# EAGLE design Doser (EAGLE 5.11)
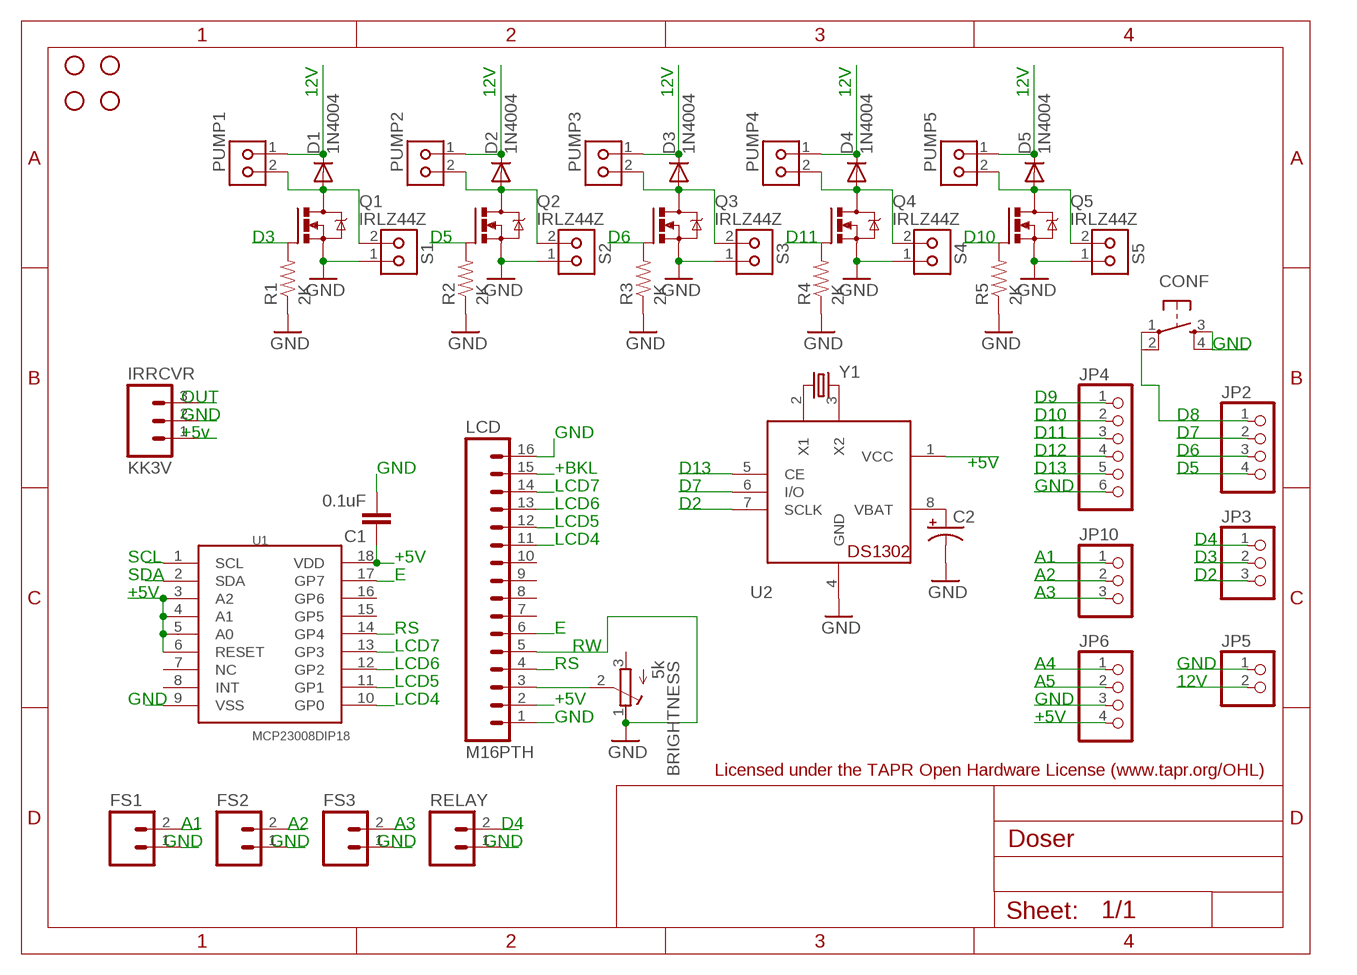
[diagram p0: schematic, sheet 1]

## Parts
BRIGHTNESS  5k  R-TRIMMT93YA  [RTRIMT93YA]
C1  0.1uF  CAPPTH  [CAP-PTH-SMALL]
C2  SUPERCAP  [414-VA5R]
CONF  TAC_SWITCHPTH  [TACTILE-PTH]
D1  1N4004  [DO41-10]
D2  1N4004  [DO41-10]
D3  1N4004  [DO41-10]
D4  1N4004  [DO41-10]
D5  1N4004  [DO41-10]
FS1  M02POLAR  [MOLEX-1X2]
FS2  M02POLAR  [MOLEX-1X2]
FS3  M02POLAR  [MOLEX-1X2]
IRRCVR  KK3V  M03POLAR  [MOLEX-1X3]
JP2  PINHD-1X4  [1X04]
JP3  PINHD-1X3  [1X03]
JP4  PINHD-1X6  [1X06]
JP5  PINHD-1X2  [1X02]
JP6  PINHD-1X4  [1X04]
JP10  PINHD-1X3  [1X03]
JP11  STAND-OFF  [STAND-OFF]
JP12  STAND-OFF  [STAND-OFF]
JP13  STAND-OFF  [STAND-OFF]
JP14  STAND-OFF  [STAND-OFF]
LCD  M16PTH  [1X16]
PUMP1  KK2VSQ  [KK-V-2-SQ]
PUMP2  KK2VSQ  [KK-V-2-SQ]
PUMP3  KK2VSQ  [KK-V-2-SQ]
PUMP4  KK2VSQ  [KK-V-2-SQ]
PUMP5  KK2VSQ  [KK-V-2-SQ]
Q1  IRLZ44Z  [TO220BH]
Q2  IRLZ44Z  [TO220BH]
Q3  IRLZ44Z  [TO220BH]
Q4  IRLZ44Z  [TO220BH]
Q5  IRLZ44Z  [TO220BH]
R1  2K  RESISTORPTH-1/4W  [AXIAL-0.4]
R2  2K  RESISTORPTH-1/4W  [AXIAL-0.4]
R3  2K  RESISTORPTH-1/4W  [AXIAL-0.4]
R4  2K  RESISTORPTH-1/4W  [AXIAL-0.4]
R5  2K  RESISTORPTH-1/4W  [AXIAL-0.4]
RELAY  M02POLAR  [MOLEX-1X2]
S1  KK2VSQ  [KK-V-2-SQ]
S2  KK2VSQ  [KK-V-2-SQ]
S3  KK2VSQ  [KK-V-2-SQ]
S4  KK2VSQ  [KK-V-2-SQ]
S5  KK2VSQ  [KK-V-2-SQ]
U1  MCP23008DIP18  [DIL18]
U2  DS1302  [DIL08-ROUND]
Y1  CRYSTALTC26H  [TC26H]

## Nets
+5V [power]: C1.1 IRRCVR.1 JP6.4 LCD.2 U1.3(A2) U1.4(A1) U1.5(A0) U1.6(RESET) U1.18(VDD) U2.1(VCC)
A1: FS1.2 JP10.1
A2: FS2.2 JP10.2
A3: FS3.2 JP10.3
D8: CONF.1 CONF.2 JP2.1
D9: JP4.1 LCD.15
D10: JP4.2 Q5.G R5.P$2
D11: JP4.3 Q4.G R4.P$2
D12: IRRCVR.3 JP4.4
D13: JP4.5 U2.5(CE)
E1: LCD.6 U1.17(GP7)
GND [power]: BRIGHTNESS.1(A) C1.2 C2.- CONF.3 CONF.4 FS1.1 FS2.1 FS3.1 IRRCVR.2 JP4.6 JP5.1 JP6.3 LCD.1 LCD.5 LCD.16 Q1.S Q2.S Q3.S Q4.S Q5.S R1.P$1 R2.P$1 R3.P$1 R4.P$1 R5.P$1 RELAY.1 S1.1 S2.1 S3.1 S4.1 S5.1 U1.9(VSS) U2.4(GND)
LCD4: LCD.11 U1.10(GP0)
LCD5: LCD.12 U1.11(GP1)
LCD6: LCD.13 U1.12(GP2)
LCD7: LCD.14 U1.13(GP3)
N$1: D2.A PUMP2.2 Q2.D S2.2
N$2: D1.A PUMP1.2 Q1.D S1.2
N$3: U2.2(X1) Y1.1
N$4: U2.3(X2) Y1.2
N$5: D3.A PUMP3.2 Q3.D S3.2
N$6: C2.+ U2.8(VBAT)
N$7: D4.A PUMP4.2 Q4.D S4.2
N$9: D5.A PUMP5.2 Q5.D S5.2
N$10: BRIGHTNESS.2(S) LCD.3
RD2: JP3.3 U2.7(SCLK)
RD3: JP3.2 Q1.G R1.P$2
RD4: JP3.1 RELAY.2
RD5: JP2.4 Q2.G R2.P$2
RD6: JP2.3 Q3.G R3.P$2
RD7: JP2.2 U2.6(I/O)
RS1: LCD.4 U1.14(GP4)
SCL: JP6.2 U1.1(SCL)
SDA: JP6.1 U1.2(SDA)
VIN: D1.C D2.C D3.C D4.C D5.C JP5.2 PUMP1.1 PUMP2.1 PUMP3.1 PUMP4.1 PUMP5.1
Unconnected: BRIGHTNESS.3(E) LCD.7 LCD.8 LCD.9 LCD.10 U1.7(NC) U1.8(INT) U1.15(GP5) U1.16(GP6)

## Notes on the sheet
- 12V | 12V | 12V | 12V | 12V
- D3 | D5 | D6 | D11 | D10
- GND
- OUT | D9
- GND | D10 | D8
- +5v | GND | D11 | D7
- +5V | D12 | D6
- GND | +BKL | D13 | D13 | D5
- LCD7 | D7 | GND
- LCD6 | D2
- LCD5
- LCD4 | D4
- SCL | +5V | A1 | D3
- SDA | E | A2 | D2
- +5V | A3
- RS | E
- LCD7 | RW
- LCD6 | RS | A4 | GND
- LCD5 | A5 | 12V
- GND | LCD4 | +5V | GND
- GND | +5V
- Licensed under the TAPR Open Hardware License (www.tapr.org/OHL)
- A1 | A2 | A3 | D4
- GND | GND | GND | GND

## Library data of the parts
BRIGHTNESS = resistor:R-TRIMM: Trimm resistor
C1 = _allyourbase:CAP: Capacitor Standard 0603 ceramic capacitor, and 0.1" leaded capacitor.
C2 = adafruit:SUPERCAP
CONF = SparkFun:TAC_SWITCH: Momentary Switch Button commonly used for reset or general input. Spark Fun Electronics SKU : COM-00097
D1-D5 = diode:1N4004: DIODE general purpose rectifier, 1 A
FS1-FS3 RELAY = SparkFun:M02: Header 2 Standard 2-pin 0.1" header. Use with straight break away headers (SKU : PRT-00116), right angle break away headers (PRT-00553), swiss pins (PRT-00743), machine pins (PRT-00117), and female headers (PRT-00115). Molex polarized connector foot print use with SKU : PRT-08233 with associated crimp pins and housings.
IRRCVR = SparkFun:M03: Header 3 Standard 3-pin 0.1" header. Use with straight break away headers (SKU : PRT-00116), right angle break away headers (PRT-00553), swiss pins (PRT-00743), machine pins (PRT-00117), and female headers (PRT-00115). Molex polarized connector foot print use with SKU : PRT-08232 with associated crimp pins and housings.
JP2 JP6 = pinhead:PINHD-1X4: PIN HEADER
JP3 JP10 = pinhead:PINHD-1X3: PIN HEADER
JP4 = pinhead:PINHD-1X6: PIN HEADER
JP5 = pinhead:PINHD-1X2: PIN HEADER
JP11-JP14 = SparkFun:STAND-OFF: Stand Off This is the mechanical footprint for a #4 phillips button head screw. Use the keepout ring to avoid running the screw head into surrounding components. SKU : PRT-00447
LCD = SparkFun:M16
PUMP1-PUMP5 S1-S5 = molex-kk:KK2*: Molex KK 2-pin connector, 100 mil pin spacing
Q1-Q5 = transistor-power:IRLZ44Z: N-Channel HEXFET® Power MOSFET Logic Level AUTOMOTIVE MOSFET Source: http://www.irf.com/product-info/datasheets/data/irlz44zpbf.pdf
R1-R5 = SparkFun:RESISTOR: Resistor Basic schematic elements and footprints for 0603, 1206, and PTH resistors.
U1 = _allyourbase:MCP23008
U2 = adafruit:DS1302: DS1302 - Real time clock with supercap trickle charger
Y1 = SparkFun:CRYSTAL: Crystals Various standard crystals. Proven footprints. Spark Fun Electronics SKU : COM-00534

## Net classes
0 default: width 0.203 mm, drill 0.508 mm, clearance 0.203 mm
1 power: width 0.254 mm, drill 0.508 mm, clearance 0.203 mm

## Board
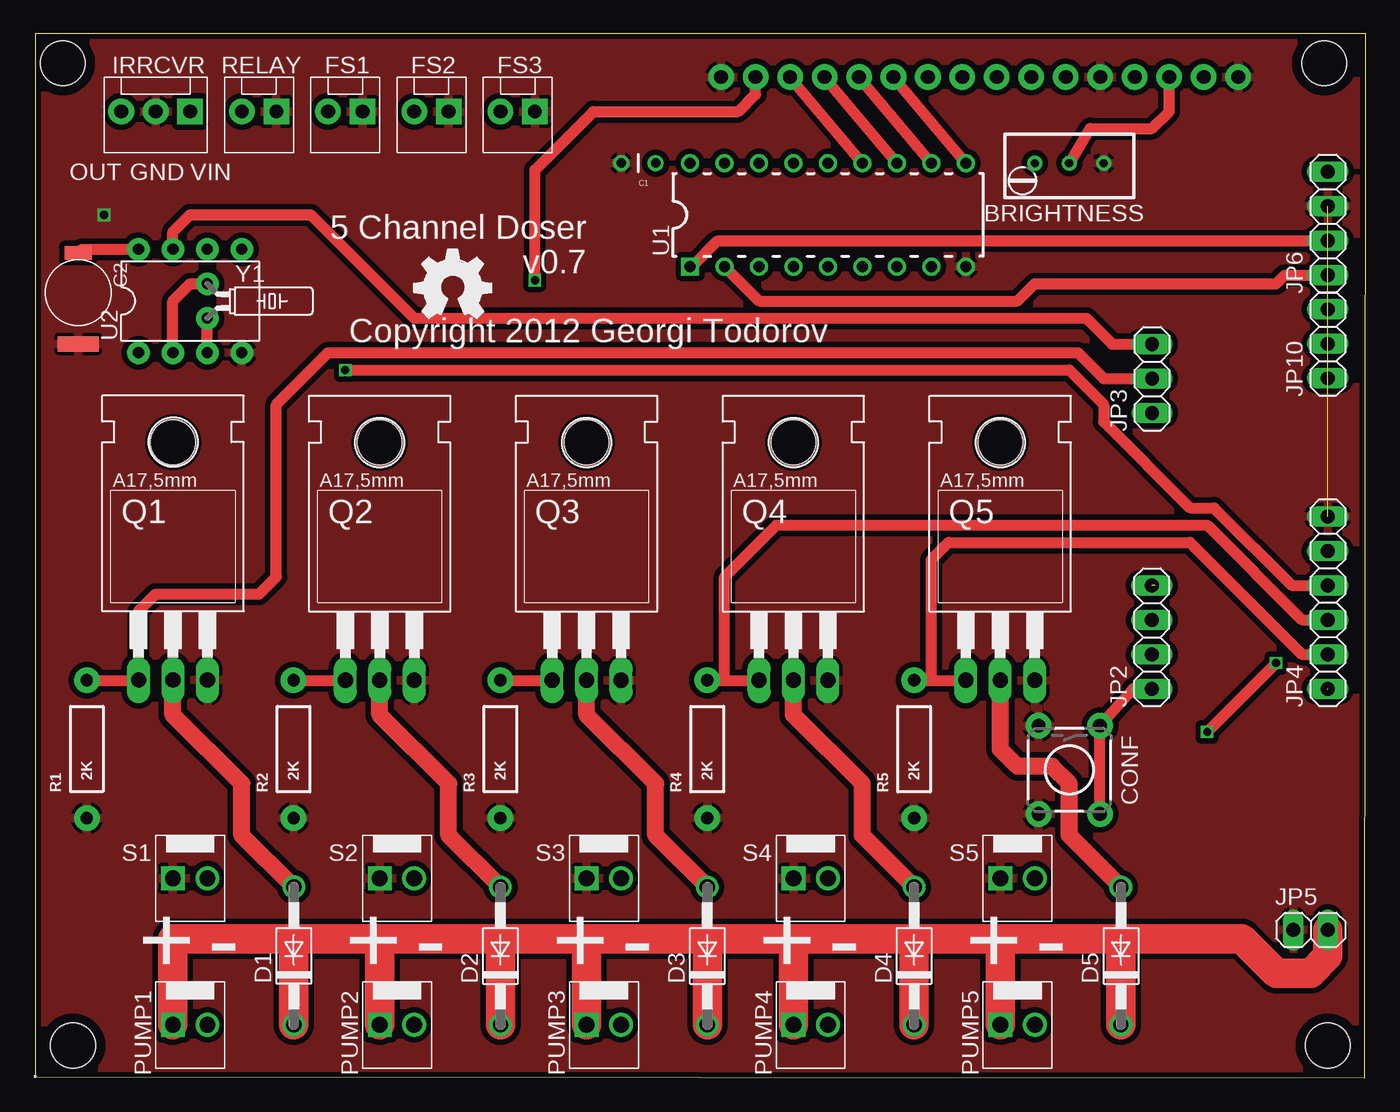
[diagram p1: board, top side]
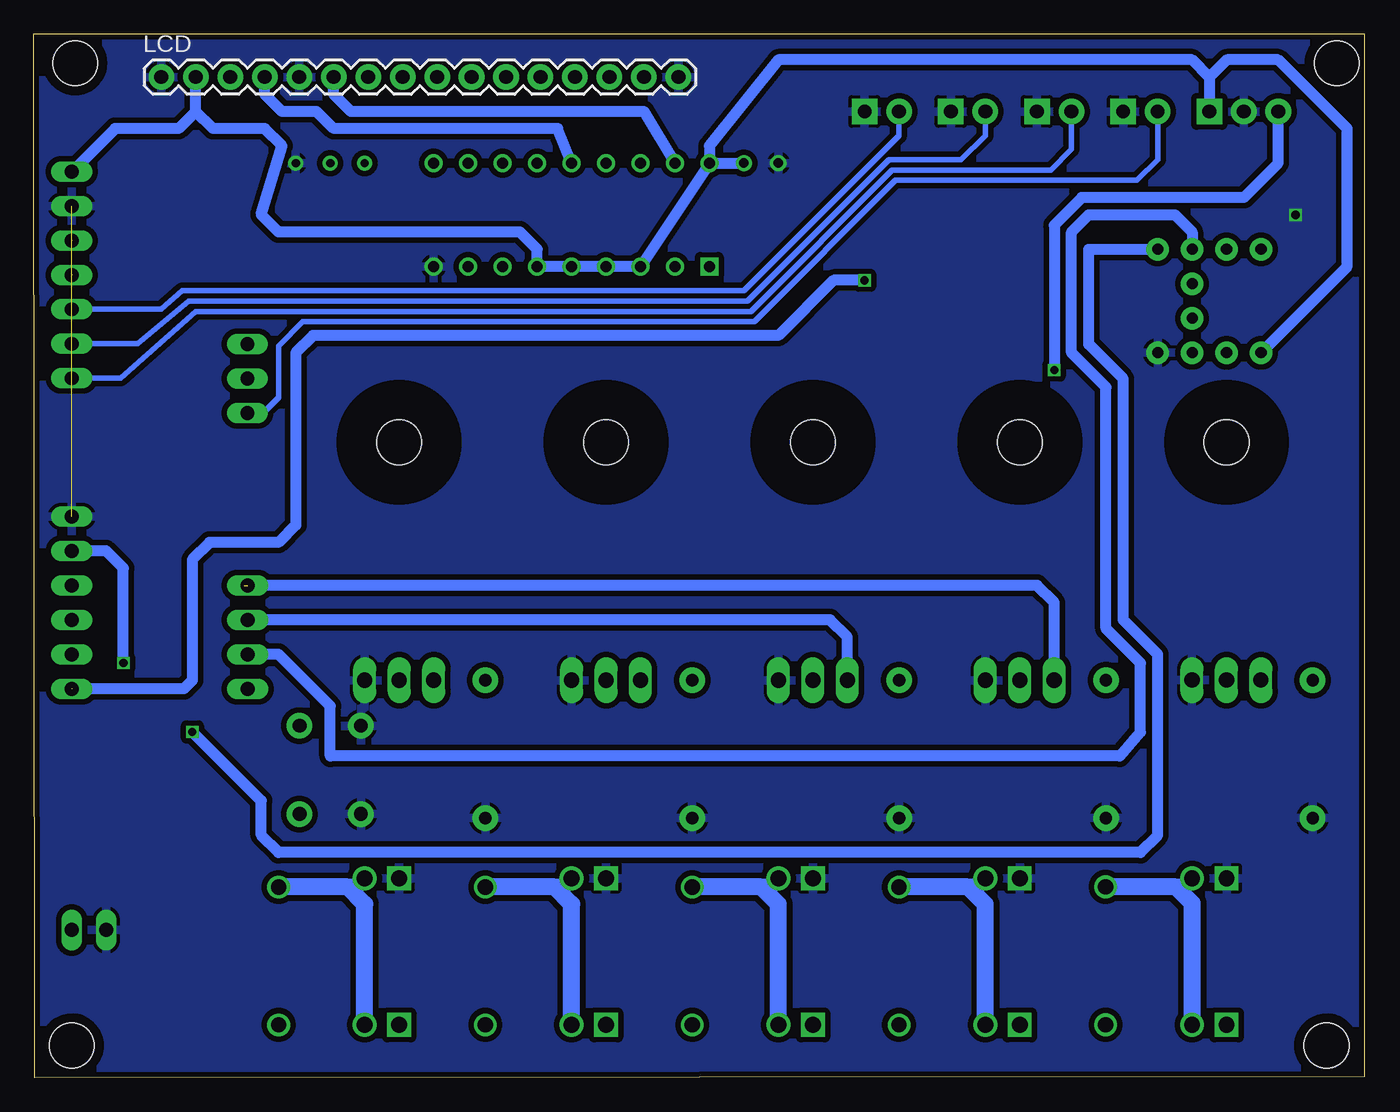
[diagram p2: board, bottom side, seen from below]

Size 98.03 x 76.91 mm. Coordinates in mm from the lower left corner, seen from the top.
Outline: 0,0.08 97.98,0 98.03,76.91 0,76.91 0,0.08
Copper layers (1*16): Top 0.035mm / dielectric 1.5mm / Bottom 0.035mm
Design rules "Fusion_eagle_rule_v1.1": minimum track width 6mil, minimum drill 12mil, track to track 6mil, track to pad 6mil, pad to pad 6mil, via to via 6mil, smd to smd 0mil, copper to edge 10mil, drill to drill 10mil, minimum pad ring 10mil, minimum via ring 6mil, stop-mask expansion 2mil, vias tented up to drill 100mil, thermal gap 10mil

### Footprints (pad centres in the part's own frame; a part is rotated, then mirrored left to right if it is on the bottom)
RTRIMT93YA = drill 0.61 round: 1 0,-2.54; 2 0,0; 3 0,2.54
CAP-PTH-SMALL = drill 0.7 round: 1 0,0; 2 2.54,0
414-VA5R = smd 1 x 2: + -2.9,0 | smd 1.1 x 3: - 3.8,0
TACTILE-PTH = drill 1.016 pad 1.88 round: 1 -3.251,2.261; 2 3.251,2.261; 3 -3.251,-2.261; 4 3.251,-2.261
DO41-10 = drill 1.118 round: A 5.08,0; C -5.08,0
MOLEX-1X2 = drill 1.016 pad 1.88 square: 1 0,0 | drill 1.016 pad 1.88 round: 2 2.54,0
MOLEX-1X3 = drill 1.016 pad 1.88 square: 1 0,0 | drill 1.016 pad 1.88 round: 2 2.54,0; 3 5.08,0
1X04 = drill 1.016 long: 1 -3.81,0; 2 -1.27,0; 3 1.27,0; 4 3.81,0
1X03 = drill 1.016 long: 1 -2.54,0; 2 0,0; 3 2.54,0
1X06 = drill 1.016 long: 1 -6.35,0; 2 -3.81,0; 3 -1.27,0; 4 1.27,0; 5 3.81,0; 6 6.35,0
1X02 = drill 1.016 long: 1 -1.27,0; 2 1.27,0
STAND-OFF = hole 3.302: 0,0
1X16 = drill 1.016 pad 1.88 round: 1 0,0; 2 2.54,0; 3 5.08,0; 4 7.62,0; 5 10.16,0; 6 12.7,0; 7 15.24,0; 8 17.78,0; 9 20.32,0; 10 22.86,0; 11 25.4,0; 12 27.94,0; 13 30.48,0; 14 33.02,0; 15 35.56,0; 16 38.1,0
KK-V-2-SQ = drill 1.168 square: 1 0,1.27 | drill 1.168 round: 2 0,-1.27
TO220BH = drill 1.118 long: D 0,-6.35; G -2.54,-6.35; S 2.54,-6.35 | hole 3.302: 0,11.176
AXIAL-0.4 = drill 0.9 pad 1.88 round: P$1 -5.08,0; P$2 5.08,0
DIL18 = drill 0.813 square: 1 -10.16,-3.81 | drill 0.813 round: 2 -7.62,-3.81; 3 -5.08,-3.81; 4 -2.54,-3.81; 5 0,-3.81; 6 2.54,-3.81; 7 5.08,-3.81; 8 7.62,-3.81; 9 10.16,-3.81; 10 10.16,3.81; 11 7.62,3.81; 12 5.08,3.81; 13 2.54,3.81; 14 0,3.81; 15 -2.54,3.81; 16 -5.08,3.81; 17 -7.62,3.81; 18 -10.16,3.81
DIL08-ROUND = drill 0.813 pad 1.676 round: 1 -3.81,-3.81; 2 -1.27,-3.81; 3 1.27,-3.81; 4 3.81,-3.81; 5 3.81,3.81; 6 1.27,3.81; 7 -1.27,3.81; 8 -3.81,3.81
TC26H = drill 0.813 pad 1.676 round: 1 -1.27,0; 2 1.27,0

### Placement (x,y rotation side)
BRIGHTNESS  76.2,67.39 90 top
C1  45.72,67.39 180 top
C2  3.17,57.86 270 top
CONF  76.2,22.68 270 top
D1  19.07,8.98 90 top
D2  34.29,8.97 90 top
D3  49.53,8.97 90 top
D4  64.77,8.97 90 top
D5  80.01,8.97 90 top
FS1  24.13,71.2 180 top
FS2  30.48,71.2 180 top
FS3  36.83,71.2 180 top
IRRCVR  11.43,71.2 180 top
JP2  82.28,32.46 90 top
JP3  82.3,51.51 90 top
JP4  95.25,35 90 top
JP5  93.99,10.89 0 top
JP6  95.25,62.94 90 top
JP10  95.25,54.08 90 top
JP11  2.79,2.36 0 top
JP12  95.25,2.36 0 top
JP13  95,74.75 0 top
JP14  2.03,74.75 0 top
LCD  88.65,73.74 0 bottom
PUMP1  11.43,3.89 90 top
PUMP2  26.67,3.89 90 top
PUMP3  41.91,3.89 90 top
PUMP4  57.15,3.89 90 top
PUMP5  72.39,3.89 90 top
Q1  10.17,35.65 0 top
Q2  25.4,35.64 0 top
Q3  40.64,35.64 0 top
Q4  55.88,35.64 0 top
Q5  71.12,35.64 0 top
R1  3.82,24.21 90 top
R2  19.05,24.21 90 top
R3  34.29,24.21 90 top
R4  49.53,24.21 90 top
R5  64.77,24.21 90 top
RELAY  17.78,71.2 180 top
S1  11.43,14.68 90 top
S2  26.67,14.68 90 top
S3  41.91,14.68 90 top
S4  57.15,14.68 90 top
S5  72.39,14.68 90 top
U1  58.42,63.58 0 top
U2  11.43,57.23 0 top
U$1  [OSHW_FILLX200_NOTEXT]  27.94,55.96 0 top
Y1  12.7,57.23 270 top

### Tracks (layer width: path | path; a pad name or v marks a point on that pad's centre or on a via)
+5V
  Bottom 0.813: U1.18 48.26,68.66 43.18,75.01 12.7,75.01 11.43,73.74 | U1.18 U1.3 U1.4 U1.5 U1.6 60.96,61.04 62.23,62.31 80.01,62.31 81.28,63.58 79.76,68.66 81.03,69.93 84.84,69.93 86.11,71.2 | 86.11,71.2 LCD.2 | 86.11,71.2 87.38,69.93 92.05,69.93 95.22,66.75 JP6.4 | U1.18 C1.1 | U2.1 1.27,59.77 1.27,69.93 6.35,75.01 10.16,75.01 11.43,73.74 | 11.43,73.74 IRRCVR.1
A1
  Bottom 0.406: FS1.2 21.59,68.4 23.11,66.88 34.8,66.88 45.21,56.46 86.11,56.46 91.64,51.54 JP10.1
A2
  Bottom 0.406: FS2.2 27.94,69.42 29.72,67.64 35.05,67.64 45.47,57.23 86.61,57.23 90.4,54.08 JP10.2
A3
  Bottom 0.406: FS3.2 34.29,69.42 45.72,57.99 87.12,57.99 88.67,56.64 JP10.3
D8
  Top 0.813: CONF.2 CONF.1 80.92,28.65 JP2.1
D9  (via drill 0.6)  (1 unrouted)
  Top 0.813: LCD.15 53.09,72.47 51.82,71.2 41.15,71.2 36.83,66.88 v36.83,58.75
  Bottom 0.813: 95.22,28.65 87,28.65 86.36,29.29 86.36,38.18 85.09,39.45 80.01,39.45 78.74,40.72 78.74,53.42 77.47,54.69 43.18,54.69 39.12,58.75 v36.83,58.75
D10
  Top 0.813: R5.P$2 66.04,29.29 | 66.04,29.29 Q5.G | JP4.2 93.34,31.19 85.09,39.45 67.31,39.45 66.04,38.18 66.04,29.29
D11
  Top 0.813: JP4.3 93.34,33.73 86.36,40.72 54.61,40.72 50.8,36.91 50.8,29.29 | R4.P$2 50.8,29.29 | 50.8,29.29 Q4.G
D12  (via drill 0.6)
  Top 0.813: v22.86,52.15 76.2,52.15 78.74,49.61 78.74,48.34 85.09,41.99 86.87,41.99 92.58,36.27 JP4.4
  Bottom 0.813: v22.86,52.15 22.86,62.81 20.83,64.85 8.89,64.85 6.35,67.39 IRRCVR.3
D13  (via drill 0.6)
  Top 0.813: v86.36,25.48 v91.44,30.56
  Bottom 0.813: JP4.5 92.71,38.81 91.44,37.54 v91.44,30.56 | U2.5 20.32,61.04 20.32,54.05 17.78,51.51 17.78,33.73 15.24,31.19 15.24,17.86 16.51,16.59 80.01,16.59 81.28,17.86 81.28,20.4 v86.36,25.48
E1
  Bottom 0.813: U1.17 53.09,71.2 74.68,71.2 75.95,72.47 LCD.6
GND  (via drill 0.6)  (1 unrouted)
  other vias: 5.08,63.58
  pour Bottom (isolate 0.406): 0,76.32 97.83,76.32 97.83,0.35 0,0.35
  pour Top (isolate 0.406): 0,76.28 97.79,76.28 97.79,0.08 0,0.08
LCD4
  Top 0.813: LCD.11 U1.10
LCD5
  Top 0.813: LCD.12 U1.11
LCD6
  Top 0.813: LCD.13 U1.12
LCD7
  Top 0.813: LCD.14 U1.13
N$1
  Top 1.27: Q2.D 25.4,26.75 30.48,21.67 30.48,17.86 D2.A
  Bottom 1.27: 29.21,14.05 D2.A | 29.21,14.05 27.94,12.78 PUMP2.2 | S2.2 28.57,14.05 29.21,14.05
N$2
  Top 1.27: Q1.D 10.16,29.28 10.16,26.75 15.24,21.67 15.24,17.86 19.04,14.06 D1.A
  Bottom 1.27: 19.06,14.05 D1.A 13.97,14.06 13.9,14.06 | PUMP1.2 12.7,12.86 13.9,14.06 | S1.2 13.32,14.06 13.9,14.06
N$3
  Top 0.813: Y1.1 11.43,58.5 10.16,57.23 U2.2
N$4
  Top 0.813: U2.3 Y1.2
N$5
  Top 1.27: Q3.D 40.64,26.75 45.72,21.67 45.72,17.86 D3.A
  Bottom 1.27: 44.45,14.05 D3.A | PUMP3.2 43.18,12.78 44.45,14.05 | S3.2 43.81,14.05 44.45,14.05
N$6
  Top 0.813: C2.+ 3.45,61.04 U2.8
N$7
  Top 1.27: Q4.D 55.88,26.75 60.96,21.67 60.96,17.86 D4.A
  Bottom 1.27: PUMP4.2 58.42,12.78 59.69,14.05 | 59.69,14.05 D4.A | S4.2 59.05,14.05 59.69,14.05
N$8
  Top 0.005: 0.02,0.03 arc10 0.03,0.03 | 0.04,0.05 arc19 0.05,0.06 | 0.05,0.09 arc19 0.04,0.1 | 0.03,0.12 arc19 0.01,0.13 | -0.01,0.13 arc19 -0.03,0.12 | -0.04,0.1 arc19 -0.05,0.09 | -0.05,0.06 arc19 -0.04,0.05 | -0.03,0.03 arc10 -0.02,0.03 | -0.01,0.05 arc-68 -0.02,0.08 | -0.02,0.08 arc-248 0.01,0.05 | 0.02,0.03 arc10 0.03,0.03 | 0.03,0.03 0.05,0.02 0.06,0.03 0.04,0.05 | 0.04,0.05 arc19 0.05,0.06 | 0.05,0.06 0.08,0.07 0.08,0.09 0.05,0.09 | 0.05,0.09 arc19 0.04,0.1 | 0.04,0.1 0.06,0.12 0.05,0.14 0.03,0.12 | 0.03,0.12 arc19 0.01,0.13 | 0.01,0.13 0.01,0.15 -0.01,0.15 -0.01,0.13 | -0.01,0.13 arc19 -0.03,0.12 | -0.03,0.12 -0.05,0.14 -0.06,0.12 -0.04,0.1 | -0.04,0.1 arc19 -0.05,0.09 | -0.05,0.09 -0.08,0.09 -0.08,0.07 -0.05,0.06 | -0.05,0.06 arc19 -0.04,0.05 | -0.04,0.05 -0.06,0.03 -0.05,0.02 -0.03,0.03 | -0.03,0.03 arc10 -0.02,0.03 | -0.02,0.03 -0.01,0.05 | -0.01,0.05 arc-68 -0.02,0.08 | -0.02,0.08 arc-248 0.01,0.05 | 0.01,0.05 0.02,0.03
N$9
  Top 1.27: D5.A 76.2,17.86 76.2,21.67 74.93,22.94 72.39,22.94 71.12,24.21 Q5.D
  Bottom 1.27: PUMP5.2 73.66,12.78 74.93,14.05 | 74.93,14.05 D5.A | S5.2 74.3,14.05 74.93,14.05
N$10
  Top 0.813: BRIGHTNESS.2 77.72,69.93 82.3,69.93 83.57,71.2 LCD.3
RD2
  Top 0.813: U2.7 10.16,62.31 11.43,63.58 20.32,63.58 27.94,55.96 77.47,55.96 79.38,54.05 JP3.3
RD3
  Top 0.813: R1.P$2 Q1.G | Q1.G 7.63,34.37 8.89,35.64 16.51,35.64 17.78,36.91 17.78,49.61 21.59,53.42 76.83,53.42 78.74,51.51 JP3.2
  Top 1.27: Q1.G
RD4
  Bottom 0.406: JP3.1 81.15,48.97 80.01,50.11 80.01,53.92 78.23,55.7 44.96,55.7 34.54,66.12 16.76,66.12 15.24,67.64 RELAY.2
RD5  (1 unrouted)
  Top 0.813: R2.P$2 Q2.G
  Bottom 0.813: 82.53,36.27 24.13,36.27 22.86,35 Q2.G
RD6
  Top 0.813: R3.P$2 Q3.G
  Bottom 0.813: JP2.3 82.53,33.73 39.37,33.73 38.1,32.46 Q3.G
RD7
  Bottom 0.813: JP2.2 82.53,31.19 80.01,31.19 76.2,27.38 76.2,23.7 18.03,23.7 16.51,25.48 16.51,30.56 19.05,33.1 19.05,50.88 21.59,53.42 21.59,62.31 20.32,63.58 13.97,63.58 12.7,62.31 U2.6
RS1
  Bottom 0.813: U1.14 59.44,69.93 75.95,69.93 77.22,71.2 79.76,71.2 81.03,72.47 LCD.4
SCL  (1 unrouted)
  Top 0.813: 95.22,61.67 50.29,61.67 48.39,59.77 U1.1
SDA  (1 unrouted)
  Top 0.813: 95.22,59.13 92.08,59.13 91.44,58.5 73.66,58.5 72.39,57.23 53.34,57.23 U1.2
VIN
  Top 2.184: JP5.2 95.25,8.97 93.98,7.7 91.44,7.7 88.9,10.24 80.01,10.24 | 19.05,10.24 10.16,10.24 PUMP1.1 | 19.05,10.24 25.4,10.24 | 25.4,10.24 34.29,10.24 | 34.29,10.24 40.64,10.24 | 40.64,10.24 49.53,10.24 | 49.53,10.24 55.88,10.24 | 55.88,10.24 64.77,10.24 | 64.77,10.24 71.12,10.24 | 71.12,10.24 80.01,10.24 | D1.C 19.05,3.92 19.05,10.24 | 25.4,10.24 PUMP2.1 | 34.29,10.24 D2.C | 40.64,10.24 PUMP3.1 | 49.53,10.24 D3.C | 55.88,10.24 PUMP4.1 | 64.77,10.24 D4.C | 71.12,10.24 PUMP5.1 | 80.01,10.24 D5.C

### Text on the board
tPlace: RELAY | FS1 | FS2 | FS3
tNames: OUT | GND | VIN | 5 Channel Doser | v0.7 | Copyright 2012 Georgi Todorov | + | - | + | - | + | - | + | - | + | -